# EAGLE design pantalla (EAGLE 7.3.0)
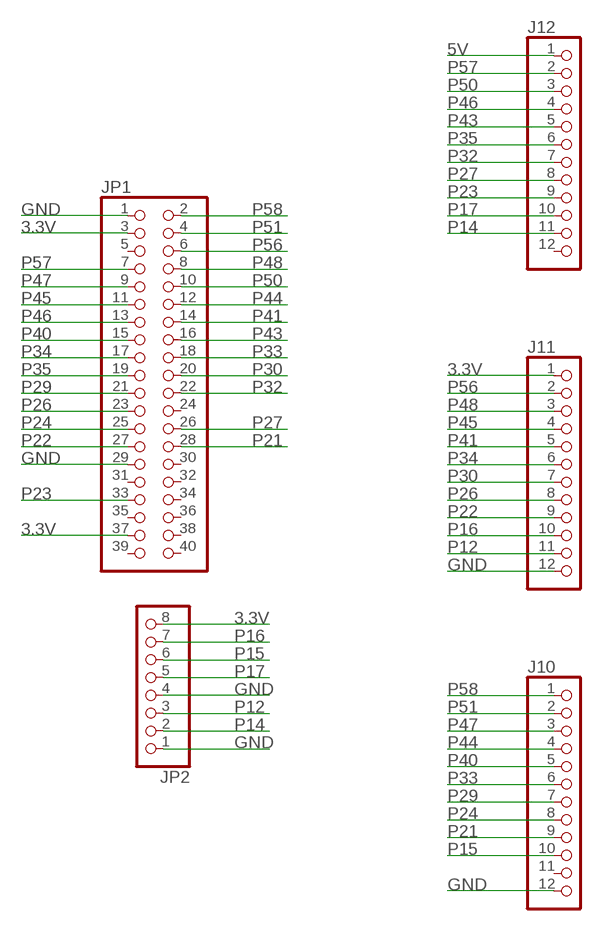
[diagram p0: schematic, sheet 1]

## Parts
J10  PINHD-1X12  [1X12]
J11  PINHD-1X12  [1X12]
J12  PINHD-1X12  [1X12]
JP1  PINHD-2X20  [2X20]
JP2  PINHD-1X8  [1X08]

## Nets
3.3V: J11.1 JP1.3 JP1.37 JP2.8
5V: J12.1
GND: J10.12 J11.12 JP1.1 JP1.29 JP2.1 JP2.4
P12: J11.11 JP2.3
P14: J12.11 JP2.2
P15: J10.10 JP2.6
P16: J11.10 JP2.7
P17: J12.10 JP2.5
P21: J10.9 JP1.28
P22: J11.9 JP1.27
P23: J12.9 JP1.33
P24: J10.8 JP1.25
P26: J11.8 JP1.23
P27: J12.8 JP1.26
P29: J10.7 JP1.21
P30: J11.7 JP1.20
P32: J12.7 JP1.22
P33: J10.6 JP1.18
P34: J11.6 JP1.17
P35: J12.6 JP1.19
P40: J10.5 JP1.15
P41: J11.5 JP1.14
P43: J12.5 JP1.16
P44: J10.4 JP1.12
P45: J11.4 JP1.11
P46: J12.4 JP1.13
P47: J10.3 JP1.9
P48: J11.3 JP1.8
P50: J12.3 JP1.10
P51: J10.2 JP1.4
P56: J11.2 JP1.6
P57: J12.2 JP1.7
P58: J10.1 JP1.2
Unconnected: J10.11 J12.12 JP1.5 JP1.24 JP1.30 JP1.31 JP1.32 JP1.34 JP1.35 JP1.36 JP1.38 JP1.39 JP1.40

## Library data of the parts
J10-J12 = pinhead:PINHD-1X12: PIN HEADER
JP1 = pinhead:PINHD-2X20: PIN HEADER
JP2 = pinhead:PINHD-1X8: PIN HEADER

## Board
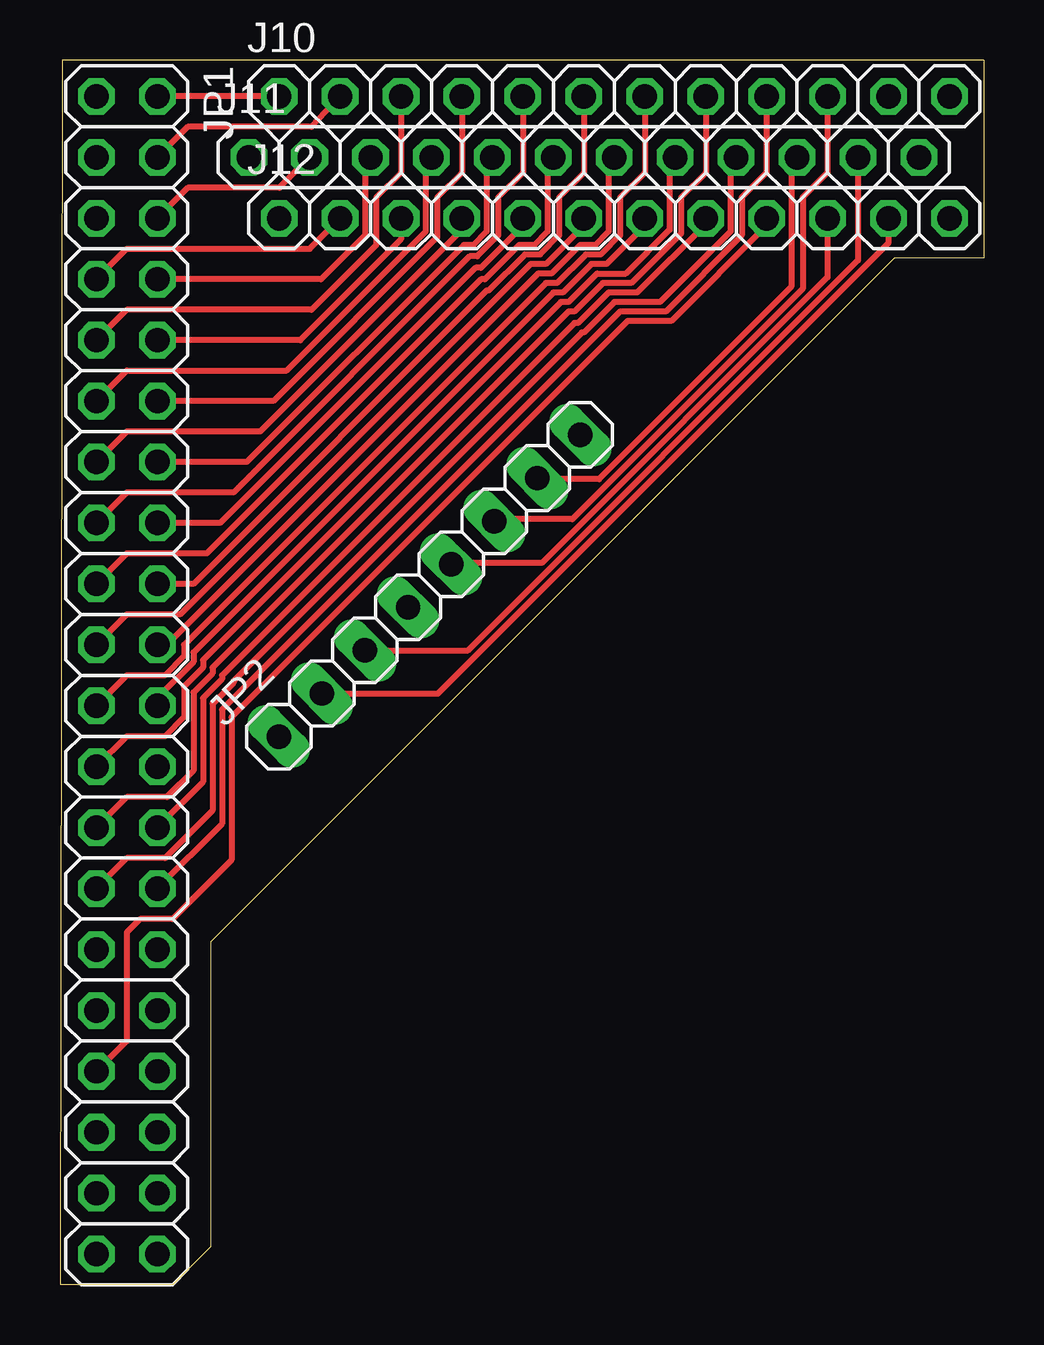
[diagram p1: board, top side]
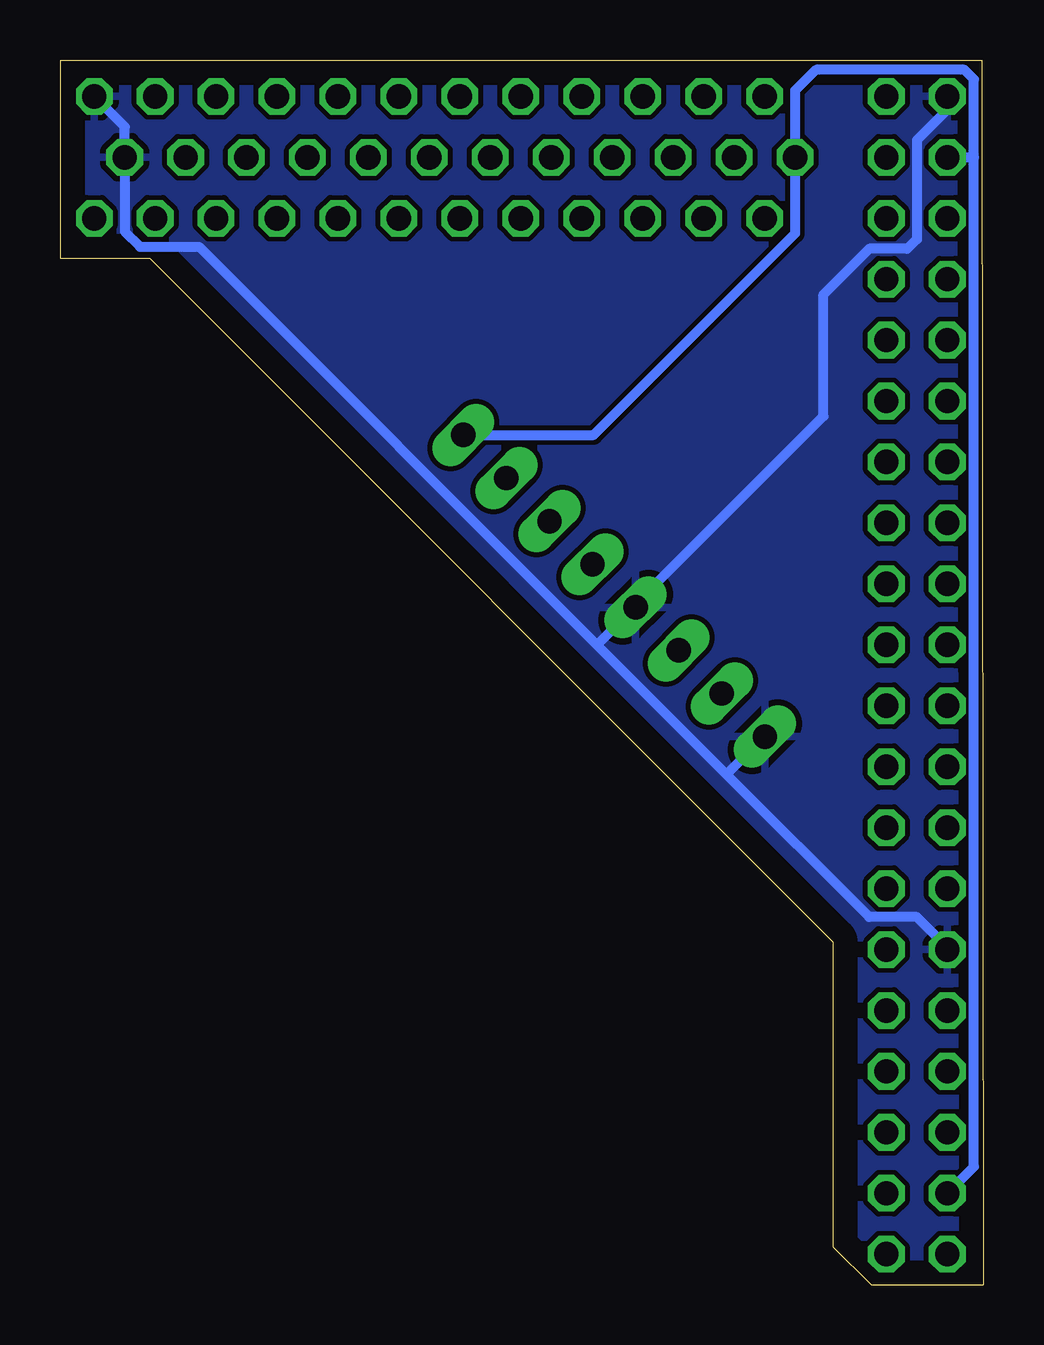
[diagram p2: board, bottom side, seen from below]

Size 38.5 x 51.04 mm. Coordinates in mm from the lower left corner, seen from the top.
Outline: 38.5,51.04 38.49,42.78
Outline: 38.49,51.03 0.08,51.03 0,0 4.68,0 6.27,1.59 6.27,14.29 34.77,42.78 38.5,42.78
Copper layers (1*16): Top 0.035mm / dielectric 1.5mm / Bottom 0.035mm
Design rules "default": minimum track width 10mil, minimum drill 24mil, track to track 8mil, track to pad 8mil, pad to pad 8mil, via to via 8mil, smd to smd 8mil, copper to edge 40mil, drill to drill 8mil, minimum pad ring 10mil, minimum via ring 8mil, stop-mask expansion 4mil, vias tented up to drill 0mil, thermal gap 10mil

### Footprints (pad centres in the part's own frame; a part is rotated, then mirrored left to right if it is on the bottom)
1X12 = drill 1.016 octagon: 1 -13.97,0; 2 -11.43,0; 3 -8.89,0; 4 -6.35,0; 5 -3.81,0; 6 -1.27,0; 7 1.27,0; 8 3.81,0; 9 6.35,0; 10 8.89,0; 11 11.43,0; 12 13.97,0
2X20 = drill 1.016 octagon: 1 -24.13,-1.27; 2 -24.13,1.27; 3 -21.59,-1.27; 4 -21.59,1.27; 5 -19.05,-1.27; 6 -19.05,1.27; 7 -16.51,-1.27; 8 -16.51,1.27; 9 -13.97,-1.27; 10 -13.97,1.27; 11 -11.43,-1.27; 12 -11.43,1.27; 13 -8.89,-1.27; 14 -8.89,1.27; 15 -6.35,-1.27; 16 -6.35,1.27; 17 -3.81,-1.27; 18 -3.81,1.27; 19 -1.27,-1.27; 20 -1.27,1.27; 21 1.27,-1.27; 22 1.27,1.27; 23 3.81,-1.27; 24 3.81,1.27; 25 6.35,-1.27; 26 6.35,1.27; 27 8.89,-1.27; 28 8.89,1.27; 29 11.43,-1.27; 30 11.43,1.27; 31 13.97,-1.27; 32 13.97,1.27; 33 16.51,-1.27; 34 16.51,1.27; 35 19.05,-1.27; 36 19.05,1.27; 37 21.59,-1.27; 38 21.59,1.27; 39 24.13,-1.27; 40 24.13,1.27
1X08 = drill 1.016 long: 1 -8.89,0; 2 -6.35,0; 3 -3.81,0; 4 -1.27,0; 5 1.27,0; 6 3.81,0; 7 6.35,0; 8 8.89,0

### Placement (x,y rotation side)
J10  23.1,49.53 0 top
J11  21.83,46.99 0 top
J12  23.1,44.45 0 top
JP1  2.78,25.4 270 top
JP2  15.4,29.13 45 top

### Tracks (layer width: path | path; a pad name or v marks a point on that pad's centre or on a via)
3.3V
  Bottom 0.406: JP2.8 16.26,35.42 7.86,43.81 J11.1 7.86,49.77 6.99,50.64 0.79,50.64 0.4,50.24 0.4,46.99 | JP1.37 0.4,4.92 0.4,46.99 | JP1.3 0.4,46.99
GND
  Bottom 0.406: J10.12 35.8,48.26 J11.12 35.8,43.89 35.16,43.26 32.7,43.26 16.11,26.67 | 16.11,26.67 14.55,28.23 JP2.4 14.5,28.36 6.67,36.2 6.67,41.27 4.76,43.18 3.17,43.18 2.78,43.58 2.78,47.7 1.51,48.97 JP1.1 | JP1.29 1.51,14.05 2.78,15.32 4.76,15.32 10.72,21.27 | 10.72,21.27 16.11,26.67 | JP2.1 9.14,22.84 10.72,21.27
  pour Bottom: 0.24,50.8 38.1,50.8 38.18,0.32 0.32,0.32
P12
  Top 0.254: J11.11 33.26,42.7 16.99,26.44 JP2.3
P14
  Top 0.254: J12.11 34.53,43.42 15.75,24.64 JP2.2
P15
  Top 0.254: J10.10 31.99,46.35 30.96,45.32 30.96,41.51 21.35,31.91 18.18,31.91 JP2.6
P16
  Top 0.254: J11.10 30.48,46.75 30.48,41.59 22.46,33.58 19.93,33.58 JP2.7
P17
  Top 0.254: JP2.5 16.35,30.08 20.08,30.08 31.99,41.99 J12.10
P21
  Top 0.254: J10.9 29.45,46.35 28.42,45.32 28.42,43.74 25.24,40.56 23.34,40.56 6.75,23.97 6.75,19.21 JP1.28
P22
  Top 0.254: J11.9 27.94,46.75 27.94,43.89 25,40.96 23.1,40.96 21.83,39.69 21.75,39.69 7.22,25.16 7.22,25.08 6.35,24.21 6.35,19.76 4.37,17.78 2.78,17.78 JP1.27
P23
  Top 0.254: J12.9 29.45,44.13 25.48,40.16 23.65,40.16 7.14,23.65 7.14,17.7 4.68,15.24 3.33,15.24 2.78,14.68 2.78,10.16 JP1.33
P24
  Top 0.254: J10.8 26.91,46.35 25.88,45.32 25.88,43.81 23.81,41.75 22.62,41.75 21.43,40.56 21.19,40.56 6.35,25.72 6.35,25.48 5.56,24.69 5.56,21.43 4.45,20.32 2.78,20.32 JP1.25
P26
  Top 0.254: J11.8 25.4,46.75 25.4,43.97 23.57,42.15 22.38,42.15 21.19,40.96 20.88,40.96 5.95,26.04 5.95,25.72 5.16,24.92 5.16,23.65 4.37,22.86 2.78,22.86 JP1.23
P27
  Top 0.254: J12.8 26.91,44.21 24.05,41.35 22.86,41.35 21.59,40.08 21.43,40.08 6.75,25.4 6.75,25.24 5.95,24.45 5.95,20.95 JP1.26
P29
  Top 0.254: J10.7 24.37,46.35 23.34,45.32 23.34,43.74 22.54,42.94 21.91,42.94 20.72,41.75 20.24,41.75 5.16,26.67 5.16,26.19 4.37,25.4 2.78,25.4 JP1.21
P30
  Top 0.254: J11.7 22.86,46.75 22.86,43.89 22.3,43.34 21.67,43.34 20.48,42.15 19.92,42.15 4.45,26.67 JP1.20
P32
  Top 0.254: J12.7 24.37,44.13 22.78,42.55 22.15,42.55 20.95,41.35 20.56,41.35 5.56,26.35 5.56,25.96 4.05,24.45 JP1.22
P33
  Top 0.254: J10.6 21.83,46.35 20.8,45.32 20.8,43.74 20,42.94 19.37,42.94 17.86,41.43 17.78,41.43 5.56,29.21 JP1.18
P34
  Top 0.254: J11.6 20.32,46.75 20.32,43.89 19.76,43.34 19.13,43.34 17.7,41.91 17.54,41.91 6.11,30.48 2.78,30.48 JP1.17
P35
  Top 0.254: J12.6 21.83,44.13 20.24,42.55 19.61,42.55 5,27.94 2.78,27.94 JP1.19
P40
  Top 0.254: J10.5 19.29,46.35 18.26,45.32 18.26,43.74 17.38,42.86 17.07,42.86 7.22,33.02 2.78,33.02 JP1.15
P41
  Top 0.254: J11.5 17.78,46.75 17.78,43.89 17.22,43.34 16.83,43.34 7.78,34.29 JP1.14
P43
  Top 0.254: J12.5 19.29,44.13 17.54,42.39 17.3,42.39 6.67,31.75 JP1.16
P44
  Top 0.254: J10.4 16.75,46.35 15.72,45.32 15.72,43.66 8.89,36.83 JP1.12
P45
  Top 0.254: JP1.11 2.78,38.1 9.45,38.1 15.24,43.89 15.24,46.75 J11.4
P46
  Top 0.254: J12.4 16.75,43.97 8.33,35.56 2.78,35.56 JP1.13
P47
  Top 0.254: J10.3 14.21,46.35 13.18,45.32 13.18,43.34 10.48,40.64 2.78,40.64 JP1.9
P48
  Top 0.254: J11.3 12.7,46.75 12.7,43.74 10.87,41.91 JP1.8
P50
  Top 0.254: J12.3 14.21,43.58 10,39.37 JP1.10
P51
  Top 0.254: J10.2 10.48,48.26 5.32,48.26 JP1.4
P56
  Top 0.254: J11.2 9.13,45.72 5.32,45.72 JP1.6
P57
  Top 0.254: JP1.7 2.78,43.18 10.4,43.18 J12.2
P58
  Top 0.254: J10.1 JP1.2